# EAGLE design rc13-mbed-main-board2 (EAGLE 6.4)
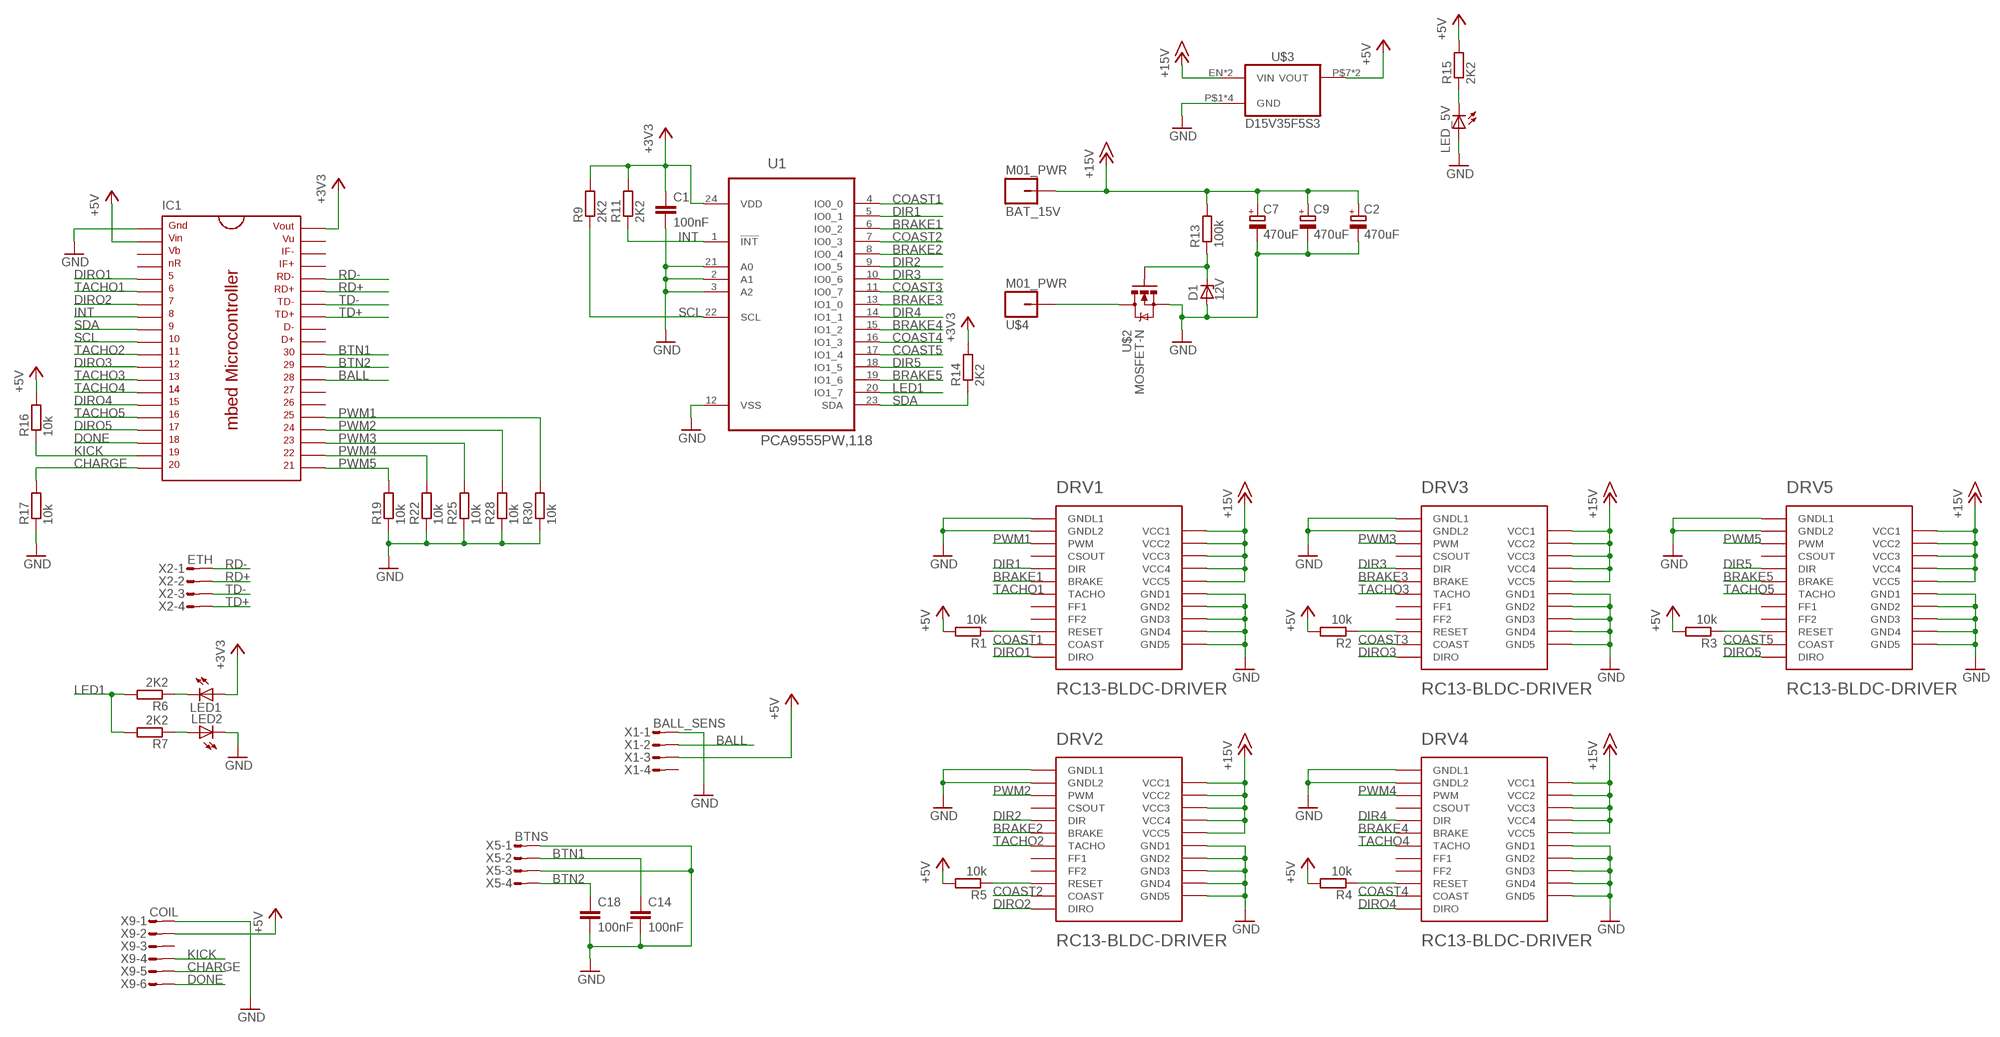
[diagram p0: schematic, sheet 1]

## Parts
BAT_15V  M01_PWR  [PWR_HOLE]
C1  100nF  C-EUC0603K  [C0603K]
C2  470uF  CPOL-EUE3.5-8  [E3,5-8]
C7  470uF  CPOL-EUE3.5-8  [E3,5-8]
C9  470uF  CPOL-EUE3.5-8  [E3,5-8]
C14  100nF  C-EUC0603K  [C0603K]
C18  100nF  C-EUC0603K  [C0603K]
D1  12V  ZENER-DIODESOD123  [SOD123]
DRV1  RC13-BLDC-DRIVER  [RC13-BLDC-DRIVER]
DRV2  RC13-BLDC-DRIVER  [RC13-BLDC-DRIVER]
DRV3  RC13-BLDC-DRIVER  [RC13-BLDC-DRIVER]
DRV4  RC13-BLDC-DRIVER  [RC13-BLDC-DRIVER]
DRV5  RC13-BLDC-DRIVER  [RC13-BLDC-DRIVER]
IC1  MBED_MICROCONTROLLER  [DIL40_0.9]
LED1  LEDCHIP-LED0603  [CHIP-LED0603]
LED2  LEDCHIP-LED0603  [CHIP-LED0603]
LED_5V  LEDCHIP-LED0603  [CHIP-LED0603]
R1  10k  R-EU_R0603  [R0603]
R2  10k  R-EU_R0603  [R0603]
R3  10k  R-EU_R0603  [R0603]
R4  10k  R-EU_R0603  [R0603]
R5  10k  R-EU_R0603  [R0603]
R6  2K2  R-EU_R0603  [R0603]
R7  2K2  R-EU_R0603  [R0603]
R9  2K2  R-EU_R0603  [R0603]
R11  2K2  R-EU_R0603  [R0603]
R13  100k  R-EU_R0603  [R0603]
R14  2K2  R-EU_R0603  [R0603]
R15  2K2  R-EU_R0603  [R0603]
R16  10k  R-EU_R0603  [R0603]
R17  10k  R-EU_R0603  [R0603]
R19  10k  R-EU_R0603  [R0603]
R22  10k  R-EU_R0603  [R0603]
R25  10k  R-EU_R0603  [R0603]
R28  10k  R-EU_R0603  [R0603]
R30  10k  R-EU_R0603  [R0603]
U1  PCA9555PW,118  [SOP65P640X110-24N]
U$2  MOSFET-N  MOSFET-N-SOT669  [TO127P600X120-5N]
U$3  D15V35F5S3  [D15V35F5S3]
U$4  M01_PWR  [PWR_HOLE]
X1  BALL_SENS  MICROMATCH-4  [MICROMATCH-4]
X2  ETH  MICROMATCH-4  [MICROMATCH-4]
X5  BTNS  MICROMATCH-4  [MICROMATCH-4]
X9  COIL  MICROMATCH-6  [MICROMATCH-6]

## Nets
+3V3: C1.1 IC1.40 LED1.A R9.2 R11.2 R14.2 U1.24(VDD)
+5V: IC1.2 R1.2 R2.2 R3.2 R4.2 R5.2 R15.2 R16.2 U$3.P$7(VOUT) U$3.P$8(VOUT) X1.3 X9.2
+15V: BAT_15V.P$1 C2.+ C7.+ C9.+ DRV1.PWR1(VCC1) DRV1.PWR2(VCC2) DRV1.PWR3(VCC3) DRV1.PWR4(VCC4) DRV1.PWR5(VCC5) DRV2.PWR1(VCC1) DRV2.PWR2(VCC2) DRV2.PWR3(VCC3) DRV2.PWR4(VCC4) DRV2.PWR5(VCC5) DRV3.PWR1(VCC1) DRV3.PWR2(VCC2) DRV3.PWR3(VCC3) DRV3.PWR4(VCC4) DRV3.PWR5(VCC5) DRV4.PWR1(VCC1) DRV4.PWR2(VCC2) DRV4.PWR3(VCC3) DRV4.PWR4(VCC4) DRV4.PWR5(VCC5) DRV5.PWR1(VCC1) DRV5.PWR2(VCC2) DRV5.PWR3(VCC3) DRV5.PWR4(VCC4) DRV5.PWR5(VCC5) R13.2 U$3.EN(VIN) U$3.P$5(VIN)
BALL: IC1.28 X1.2
BAT_GND: U$2.5(D) U$4.P$1
BRAKE1: DRV1.LOGIC6(BRAKE) U1.6(IO0_2)
BRAKE2: DRV2.LOGIC6(BRAKE) U1.8(IO0_4)
BRAKE3: DRV3.LOGIC6(BRAKE) U1.13(IO1_0)
BRAKE4: DRV4.LOGIC6(BRAKE) U1.15(IO1_2)
BRAKE5: DRV5.LOGIC6(BRAKE) U1.19(IO1_6)
BTN1: C14.1 IC1.30 X5.2
BTN2: C18.1 IC1.29 X5.4
CHARGE: IC1.20 R17.2 X9.5
COAST1: DRV1.LOGIC11(COAST) U1.4(IO0_0)
COAST2: DRV2.LOGIC11(COAST) U1.7(IO0_3)
COAST3: DRV3.LOGIC11(COAST) U1.11(IO0_7)
COAST4: DRV4.LOGIC11(COAST) U1.16(IO1_3)
COAST5: DRV5.LOGIC11(COAST) U1.17(IO1_4)
DIR1: DRV1.LOGIC5(DIR) U1.5(IO0_1)
DIR2: DRV2.LOGIC5(DIR) U1.9(IO0_5)
DIR3: DRV3.LOGIC5(DIR) U1.10(IO0_6)
DIR4: DRV4.LOGIC5(DIR) U1.14(IO1_1)
DIR5: DRV5.LOGIC5(DIR) U1.18(IO1_5)
DIRO1: DRV1.LOGIC12(DIRO) IC1.5
DIRO2: DRV2.LOGIC12(DIRO) IC1.7
DIRO3: DRV3.LOGIC12(DIRO) IC1.12
DIRO4: DRV4.LOGIC12(DIRO) IC1.15
DIRO5: DRV5.LOGIC12(DIRO) IC1.17
DONE: IC1.18 X9.6
GND: C1.2 C2.- C7.- C9.- C14.2 C18.2 D1.A DRV1.LOGIC1(GNDL1) DRV1.LOGIC2(GNDL2) DRV1.PWR6(GND1) DRV1.PWR7(GND2) DRV1.PWR8(GND3) DRV1.PWR9(GND4) DRV1.PWR10(GND5) DRV2.LOGIC1(GNDL1) DRV2.LOGIC2(GNDL2) DRV2.PWR6(GND1) DRV2.PWR7(GND2) DRV2.PWR8(GND3) DRV2.PWR9(GND4) DRV2.PWR10(GND5) DRV3.LOGIC1(GNDL1) DRV3.LOGIC2(GNDL2) DRV3.PWR6(GND1) DRV3.PWR7(GND2) DRV3.PWR8(GND3) DRV3.PWR9(GND4) DRV3.PWR10(GND5) DRV4.LOGIC1(GNDL1) DRV4.LOGIC2(GNDL2) DRV4.PWR6(GND1) DRV4.PWR7(GND2) DRV4.PWR8(GND3) DRV4.PWR9(GND4) DRV4.PWR10(GND5) DRV5.LOGIC1(GNDL1) DRV5.LOGIC2(GNDL2) DRV5.PWR6(GND1) DRV5.PWR7(GND2) DRV5.PWR8(GND3) DRV5.PWR9(GND4) DRV5.PWR10(GND5) IC1.1 LED2.C LED_5V.A R17.1 R19.1 R22.1 R25.1 R28.1 R30.1 U1.2(A1) U1.3(A2) U1.12(VSS) U1.21(A0) U$2.1(S) U$2.2(S) U$2.3(S) U$3.P$1(GND) U$3.P$2(GND) U$3.P$3(GND) U$3.P$4(GND) X1.1 X5.1 X5.3 X9.1
INT: IC1.8 R11.1 U1.1(!INT)
KICK: IC1.19 R16.1 X9.4
LED1: R6.2 R7.2 U1.20(IO1_7)
N$2: DRV1.LOGIC10(RESET) R1.1
N$3: DRV2.LOGIC10(RESET) R5.1
N$4: DRV4.LOGIC10(RESET) R4.1
N$5: DRV5.LOGIC10(RESET) R3.1
N$6: DRV3.LOGIC10(RESET) R2.1
N$7: LED1.C R6.1
N$8: LED2.A R7.1
N$9: LED_5V.C R15.1
N$20: D1.C R13.1 U$2.4(G)
PWM1: DRV1.LOGIC3(PWM) IC1.25 R30.2
PWM2: DRV2.LOGIC3(PWM) IC1.24 R28.2
PWM3: DRV3.LOGIC3(PWM) IC1.23 R25.2
PWM4: DRV4.LOGIC3(PWM) IC1.22 R22.2
PWM5: DRV5.LOGIC3(PWM) IC1.21 R19.2
RD+: IC1.35 X2.2
RD-: IC1.36 X2.1
SCL: IC1.10 R9.1 U1.22(SCL)
SDA: IC1.9 R14.1 U1.23(SDA)
TACHO1: DRV1.LOGIC7(TACHO) IC1.6
TACHO2: DRV2.LOGIC7(TACHO) IC1.11
TACHO3: DRV3.LOGIC7(TACHO) IC1.13
TACHO4: DRV4.LOGIC7(TACHO) IC1.14
TACHO5: DRV5.LOGIC7(TACHO) IC1.16
TD+: IC1.33 X2.4
TD-: IC1.34 X2.3
Unconnected: DRV1.LOGIC4(CSOUT) DRV1.LOGIC8(FF1) DRV1.LOGIC9(FF2) DRV2.LOGIC4(CSOUT) DRV2.LOGIC8(FF1) DRV2.LOGIC9(FF2) DRV3.LOGIC4(CSOUT) DRV3.LOGIC8(FF1) DRV3.LOGIC9(FF2) DRV4.LOGIC4(CSOUT) DRV4.LOGIC8(FF1) DRV4.LOGIC9(FF2) DRV5.LOGIC4(CSOUT) DRV5.LOGIC8(FF1) DRV5.LOGIC9(FF2) IC1.3 IC1.4 IC1.26 IC1.27 IC1.31 IC1.32 IC1.37 IC1.38 IC1.39 X1.4 X9.3

## Library data of the parts
BAT_15V U$4 = tellis2:M01_PWR
C1 C14 C18 = rcl:C-EU: CAPACITOR, European symbol
C2 C7 C9 = rcl:CPOL-EU: POLARIZED CAPACITOR, European symbol
D1 = diode:ZENER-DIODE: Z-Diode
DRV1-DRV5 = rc13-bldc-driver:RC13-BLDC-DRIVER
IC1 = mbed-microcontroller:MBED_MICROCONTROLLER: mbed Microcontroller, DIP40, 0.9"
LED1 LED2 LED_5V = led:LED: LED OSRAM: - CHIPLED LG R971, LG N971, LY N971, LG Q971, LY Q971, LO R971, LY R971 LH N974, LH R974 LS Q976, LO Q976, LY Q976 LO Q996 - Hyper CHIPLED LW Q18S LB Q993, LB Q99A, LB R99A - SideLED LS A670, LO A670, LY A670, LG A670, LP A670 LB A673, LV A673, LT A673, LW A673 LH A674 LY A675 LS A676, LA A676, LO A676, LY A676, LW A676 LS A679, LY A679, LG A679 - Hyper Micro SIDELED® LS Y876, LA Y876, LO Y876, LY Y876 LT Y87S - SmartLED LW L88C, LW L88S LB L89C, LB L89S, LG L890 LS L89K, LO L89K, LY L89K LS L896, LA L896, LO L896, LY L896 - TOPLED LS T670, LO T670, LY T670, LG T670, LP T670 LSG T670, LSP T670, LSY T670, LOP T670, LYG T670 LG T671, LOG T671, LSG T671 LB T673, LV T673, LT T673, LW T673 LH T674 LS T676, LA T676, LO T676, LY T676, LB T676, LH T676, LSB T676, LW T676 LB T67C, LV T67C, LT T67C, LS T67K, LO T67K, LY T67K, LW E67C LS E67B, LA E67B, LO E67B, LY E67B, LB E67C, LV E67C, LT E67C LW T67C LS T679, LY T679, LG T679 LS T770, LO T770, LY T770, LG T770, LP T770 LB T773, LV T773, LT T773, LW T773 LH T774 LS E675, LA E675, LY E675, LS T675 LS T776, LA T776, LO T776, LY T776, LB T776 LHGB T686 LT T68C, LB T68C - Hyper Mini TOPLED® LB M676 - Mini TOPLED Santana® LG M470 LS M47K, LO M47K, LY M47K Source: http://www.osram.convergy.de LUXEON: - LUMILED® LXK2-PW12-R00, LXK2-PW12-S00, LXK2-PW14-U00, LXK2-PW14-V00 LXK2-PM12-R00, LXK2-PM12-S00, LXK2-PM14-U00 LXK2-PE12-Q00, LXK2-PE12-R00, LXK2-PE12-S00, LXK2-PE14-T00, LXK2-PE14-U00 LXK2-PB12-K00, LXK2-PB12-L00, LXK2-PB12-M00, LXK2-PB14-N00, LXK2-PB14-P00, LXK2-PB14-Q00 LXK2-PR12-L00, LXK2-PR12-M00, LXK2-PR14-Q00, LXK2-PR14-R00 LXK2-PD12-Q00, LXK2-PD12-R00, LXK2-PD12-S00 LXK2-PH12-R00, LXK2-PH12-S00 LXK2-PL12-P00, LXK2-PL12-Q00, LXK2-PL12-R00 Source: www.luxeon.com KINGBRIGHT: KA-3528ASYC Source: www.kingbright.com
R1-R7 R9 R11 R13-R17 R19 R22 R25 R28 R30 = rcl:R-EU_: RESISTOR, European symbol
U1 = PCA9555:PCA9555PW,118: IC, I/O EXPANDER, 16BIT, 24TSSOP; MPN: PCA9555PW,118; OC_FARNELL: 2101299; OC_NEWARK: 70R6680; PACKAGE: 24TSSOP; SUPPLIER: NXP
U$2 = nxp_sot669:MOSFET-N-SOT669
U$3 = D15V35F5S3:D15V35F5S3
X1 X2 X5 = con-amp-micromatch:MICROMATCH-4: MicroMaTch 4 7-215464-4 / 0-215464-4 Drawing Number C-215464 DDEController.pdf; MPN: 7-215464-4; OC_FARNELL: 3784629; OC_NEWARK: 19R8124
X9 = con-amp-micromatch:MICROMATCH-6: MicroMaTch 6 7-215464-6 / 0-215464-6 Drawing Number C-215464 DDEController.pdf; MPN: 7-215464-6; OC_FARNELL: 3784630; OC_NEWARK: 19R8125

## Board
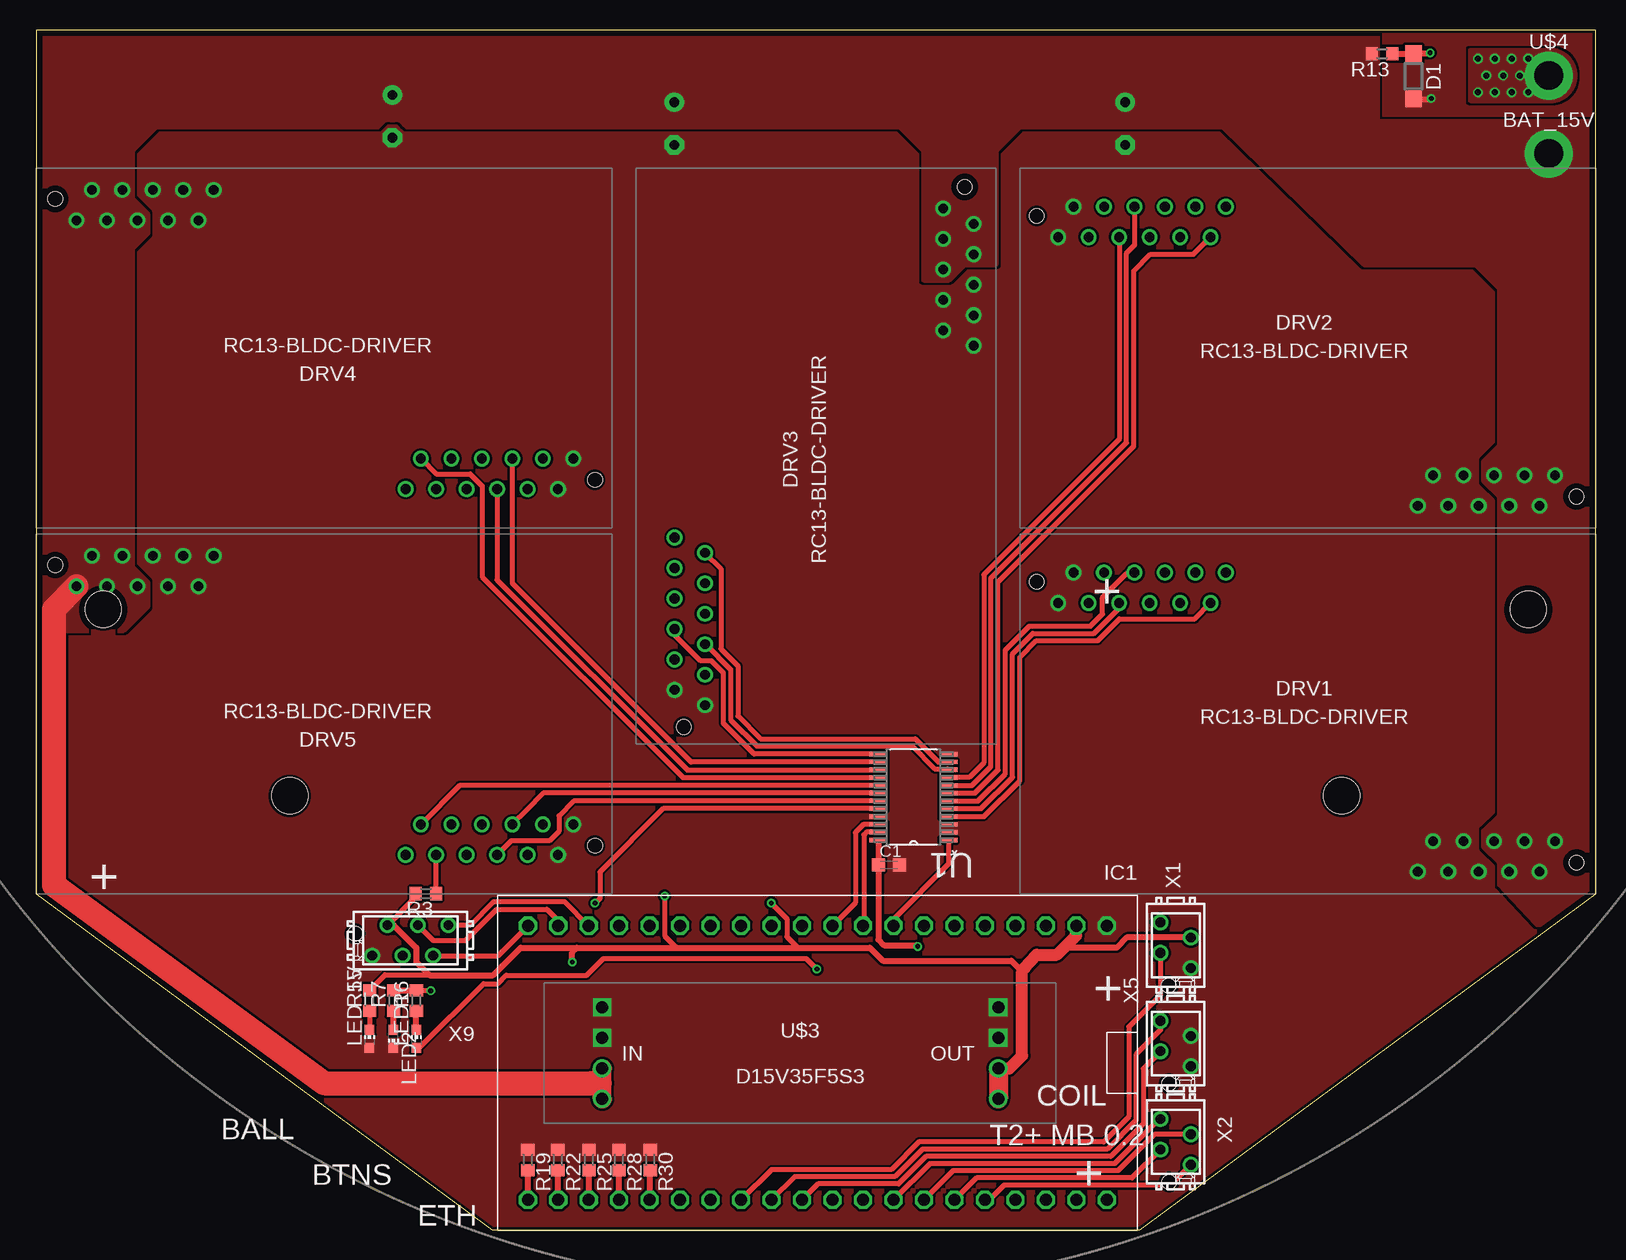
[diagram p1: board, top side]
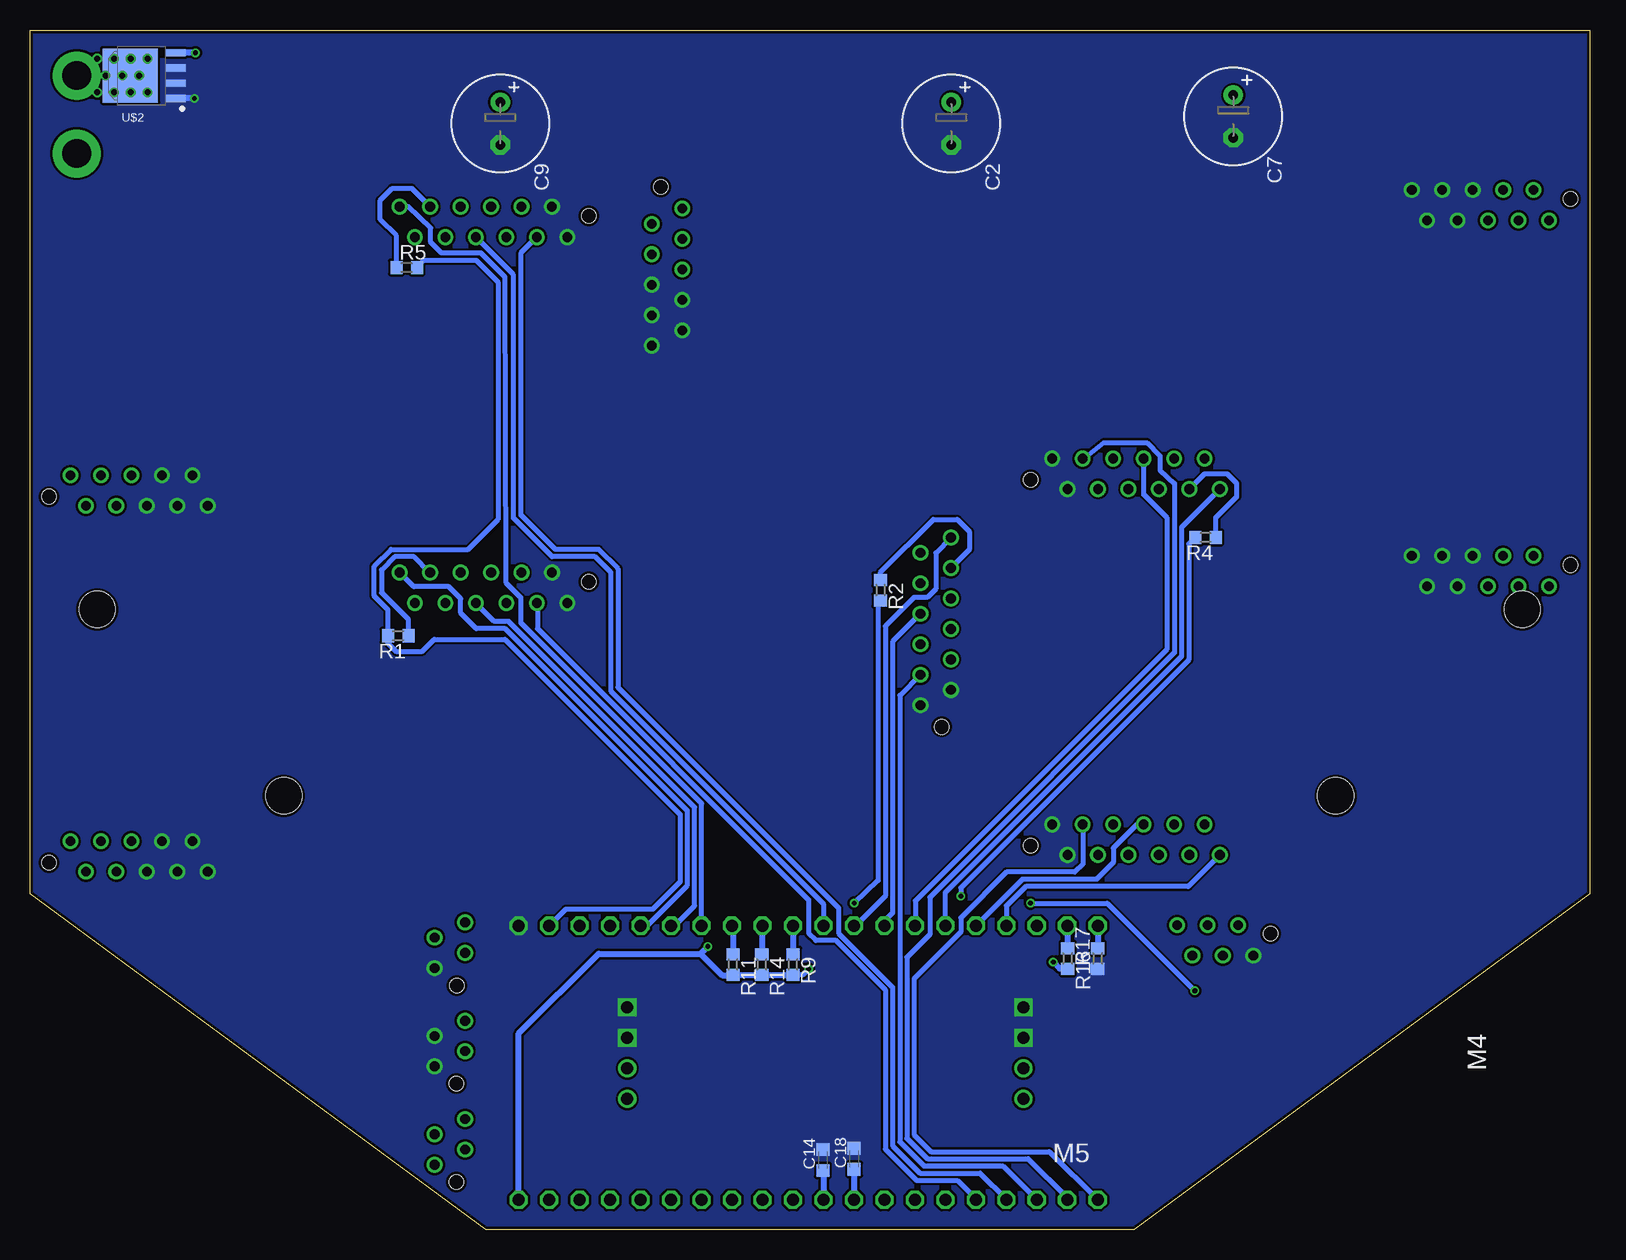
[diagram p2: board, bottom side, seen from below]

Size 130 x 100 mm. Coordinates in mm from the lower left corner, seen from the top.
Outline: 0,28 38,0 92,0 130,28 130,100 0,100 0,28
Copper layers (1*16): Top 0.035mm / dielectric 1.5mm / Bottom 0.035mm
Design rules "Fusion_eagle_rule_v1.1": minimum track width 6mil, minimum drill 12mil, track to track 6mil, track to pad 6mil, pad to pad 6mil, via to via 6mil, smd to smd 0mil, copper to edge 10mil, drill to drill 10mil, minimum pad ring 10mil, minimum via ring 6mil, stop-mask expansion 2mil, vias tented up to drill 100mil, thermal gap 10mil
Holes 1.2 mm at 94.45,3.95 94.45,12.15 94.4,20.35 26.6,24.65
Holes 3 mm at 5.6,51.7 21.16,36.16 108.84,36.16 124.4,51.7

### Footprints (pad centres in the part's own frame; a part is rotated, then mirrored left to right if it is on the bottom)
PWR_HOLE = drill 2.4 pad 4: P$1 0,0
C0603K = smd 1.05 x 1.08: 1 -0.875,0; 2 0.875,0
E3,5-8 = drill 0.813 pad 1.6: + -1.778,0 | drill 0.813 pad 1.6 octagon: - 1.778,0
SOD123 = smd 1.4 x 1.4: A 1.9,0; C -1.9,0
RC13-BLDC-DRIVER = drill 0.8 pad 1.3: LOGIC1 3.215,24.23; LOGIC2 4.485,26.77; LOGIC3 5.755,24.23; LOGIC4 7.025,26.77; LOGIC5 8.295,24.23; LOGIC6 9.565,26.77; LOGIC7 10.835,24.23; LOGIC8 12.105,26.77; LOGIC9 13.375,24.23; LOGIC10 14.645,26.77; LOGIC11 15.915,24.23; LOGIC12 17.185,26.77; PWR1 44.615,4.37; PWR2 43.345,1.83; PWR3 42.075,4.37; PWR4 40.805,1.83; PWR5 39.535,4.37; PWR6 38.265,1.83; PWR7 36.995,4.37; PWR8 35.725,1.83; PWR9 34.455,4.37; PWR10 33.185,1.83 | hole 1.2: 1.4,26; 46.4,2.6
DIL40_0.9 = drill 1 pad 1.397 octagon: 1 -22.86,-11.43; 2 -20.32,-11.43; 3 -17.78,-11.43; 4 -15.24,-11.43; 5 -12.7,-11.43; 6 -10.16,-11.43; 7 -7.62,-11.43; 8 -5.08,-11.43; 9 -2.54,-11.43; 10 0,-11.43; 11 2.54,-11.43; 12 5.08,-11.43; 13 7.62,-11.43; 14 10.16,-11.43; 15 12.7,-11.43; 16 15.24,-11.43; 17 17.78,-11.43; 18 20.32,-11.43; 19 22.86,-11.43; 20 25.4,-11.43; 21 25.4,11.43; 22 22.86,11.43; 23 20.32,11.43; 24 17.78,11.43; 25 15.24,11.43; 26 12.7,11.43; 27 10.16,11.43; 28 7.62,11.43; 29 5.08,11.43; 30 2.54,11.43; 31 0,11.43; 32 -2.54,11.43; 33 -5.08,11.43; 34 -7.62,11.43; 35 -10.16,11.43; 36 -12.7,11.43; 37 -15.24,11.43; 38 -17.78,11.43; 39 -20.32,11.43; 40 -22.86,11.43
CHIP-LED0603 = smd 0.8 x 0.8: A 0,-0.75; C 0,0.75
R0603 = smd 1 x 1.1: 1 -0.85,0; 2 0.85,0
SOP65P640X110-24N = smd 1.473 x 0.356: 1 -2.921,3.581; 2 -2.921,2.921; 3 -2.921,2.286; 4 -2.921,1.626; 5 -2.921,0.965; 6 -2.921,0.33; 7 -2.921,-0.33; 8 -2.921,-0.965; 9 -2.921,-1.626; 10 -2.921,-2.286; 11 -2.921,-2.921; 12 -2.921,-3.581; 13 2.921,-3.581; 14 2.921,-2.921; 15 2.921,-2.286; 16 2.921,-1.626; 17 2.921,-0.965; 18 2.921,-0.33; 19 2.921,0.33; 20 2.921,0.965; 21 2.921,1.626; 22 2.921,2.286; 23 2.921,2.921; 24 2.921,3.581
TO127P600X120-5N = smd 1.65 x 0.6: 1 -2.65,1.905; 2 -2.65,0.635; 3 -2.65,-0.635; 4 -2.65,-1.905 | smd 4.6 x 4.5: 5 1.15,0
D15V35F5S3 = drill 1: EN -16.51,-3.81; P$5 -16.51,-1.27; P$7 16.51,-1.27; P$8 16.51,-3.81 | drill 1 square: P$1 -16.51,3.81; P$2 -16.51,1.27; P$3 16.51,3.81; P$4 16.51,1.27
MICROMATCH-4 = drill 0.813: 1 1.905,1.27; 2 0.635,-1.27; 3 -0.635,1.27; 4 -1.905,-1.27
MICROMATCH-6 = drill 0.813: 1 3.175,1.27; 2 1.905,-1.27; 3 0.635,1.27; 4 -0.635,-1.27; 5 -1.905,1.27; 6 -3.175,-1.27

### Placement (x,y rotation side)
BAT_15V  126.1,89.7 0 top
C1  71.1,30.4 0 top
C2  53.2,92.2 270 bottom
C7  29.7,92.8 270 bottom
C9  90.8,92.2 270 bottom
C14  63.9,5.8 90 bottom
C18  61.3,5.9 90 bottom
D1  114.84,96.15 270 top
DRV1  82,28 0 top
DRV2  82,58.5 0 top
DRV3  80,40.5 90 top
DRV4  48,88.5 180 top
DRV5  48,58 180 top
IC1  66.4,13.9 180 top
LED1  31.7,15.9 0 top
LED2  29.8,15.9 180 top
LED_5V  27.8,15.9 0 top
R1  99.3,49.5 180 bottom
R2  59.1,53.3 270 bottom
R3  32.5,28 180 top
R4  32,57.7 180 bottom
R5  98.6,80.2 0 bottom
R6  31.7,19.1 90 top
R7  29.8,19.1 90 top
R9  66.4,22.1 270 bottom
R11  71.4,22.1 270 bottom
R13  112.21,98.01 180 top
R14  69,22.1 270 bottom
R15  27.8,19.1 90 top
R16  43.5,22.6 270 bottom
R17  41,22.6 90 bottom
R19  41,5.8 270 top
R22  43.5,5.8 270 top
R25  46.1,5.8 270 top
R28  48.6,5.8 270 top
R30  51.2,5.8 270 top
U1  73.15,36.05 180 top
U$2  120.5,96.2 180 bottom
U$3  63.7,14.7 0 top
U$4  126.1,96.2 0 top
X1  95,23.7 270 top
X2  95,7.3 270 top
X5  95,15.5 270 top
X9  31.2,24.1 180 top

### Tracks (layer width: path | path; a pad name or v marks a point on that pad's centre or on a via)
+3V3  (via drill 0.4)
  Top 0.4: LED1.A 31.95,15.15 37.3,20.5 38.5,20.5 39.2,21.2 45.9,21.2 47.3,22.6 64.2,22.6 v65.1,21.7
  Top 0.5: U1.24 C1.1 70.22,24.18 70.7,23.7 73.4,23.7 v73.5,23.6
  Bottom 0.4: v65.1,21.7 65.55,21.25 R9.2
  Bottom 0.5: IC1.40 89.26,16.34 82.6,23 74.1,23 | 74.1,23 72.3,21.2 71.45,21.2 R11.2 R14.2 R9.2 | v73.5,23.6 74.1,23
+5V  (via drill 0.4)
  Top 0.4: 31.65,27.73 X9.2 | R15.2 29.1,21.25 32.75,21.25 | v61.3,27.2 62.6,25.9 62.6,24.4 63.5,23.5 | v52.4,27.8 52.4,24.5 53.4,23.5
  Top 0.5: X1.3 90.94,24.34 90.1,23.5 85.7,23.5 | X9.2 29.83,25.37 31.7,23.5 31.7,22.3 32.75,21.25 32.8,21.2 38.1,21.2 40.4,23.5 45.1,23.5 | 82.4,21.8 81.9,21.8 81.3,22.4 70.6,22.4 69.5,23.5 63.5,23.5 53.4,23.5 45.1,23.5 | R3.2 31.65,27.73 | v44.7,22.3 44.7,23.1 45.1,23.5 | 87,25.61 IC1.2
  Top 1: U$3.P$7 81.13,13.43 82.2,14.5 82.2,21.5 82.4,21.8 83.4,22.9 85.1,22.9 85.7,23.5 86.7,24.5 86.7,25.31 IC1.2
  Top 1.6: U$3.P$7 U$3.P$8
  Bottom 0.4: v61.3,27.2 59.3,29.1 59.3,52.25 R2.2 | R4.2 33.4,57.15 33.4,47.5 52.4,28.5 v52.4,27.8 | R5.2 97.15,80.8 92.8,80.8 91,79 91,59.2 93.5,56.7 99.9,56.7 101.3,55.3 101.3,52.8 100.15,51.65 R1.2 100.15,48.85 99.5,48.2 97.3,48.2 96.3,49.2 90.4,49.2 75.8,34.6 75.8,29 78.1,26.7 85.35,26.7 IC1.2
  Bottom 0.5: R16.2 44.15,21.75 v44.7,22.3
+15V
  Top 1.6: U$3.EN 47.19,12.2 | 47.19,12.2 U$3.P$5 | 46.3,12.2 47.19,12.2
  Top 2: DRV5.PWR1 1.5,51.72 1.5,28.7 24,12.2 46.3,12.2
  pour Top (isolate 0.5, no thermals): 122,30.6 122,28.8 125.7,24.9 130,28 129.9,92.3 111.8,92.3 111.8,99.9 0,100 0,50 7.3,50 9.3,52 9.3,53.9 8,55.2 8,81.8 9.3,83.1 9.3,84.6 8,85.9 8,90 10,92 72,92 74,90 74,79.2 76.1,79.2 77.4,80.5 80,80.5 80,90 82,92 98.9,92 110.7,80.5 120,80.5 122,78.5 122,65.3 120.7,64 120.7,62.4 122,61.1 122,34.5 120.7,33.2 120.7,31.9
BALL
  Top 0.4: X1.2 93.73,19.53 91.1,16.9 91.1,9.4 89,7.3 73.6,7.3 71.3,5 61.31,5 IC1.28
BAT_GND  (via drill 0.5)
  Bottom 0.4: v122.3,96.2 U$2.5
  other vias: 120.2,97.6 120.9,96.2 120.2,94.8 121.6,97.6 121.6,94.8 123,97.6 123.7,96.2 123,94.8 124.4,97.6 124.4,94.8
  pour Top (isolate 0.5, no thermals): 119.6,98.25 119.6,94.15 126.25,94.15 arc90 128.25,96.15 128.25,96.25 arc90 126.25,98.25
BRAKE1
  Top 0.4: U1.6 78.52,35.72 80.8,38 80.8,48.3 82.8,50.3 87.9,50.3 88.9,51.3 88.9,52.7 90.9,54.7 91.5,54.7 DRV1.LOGIC6
BRAKE2
  Top 0.4: U1.8 78.02,37.02 79.6,38.6 79.6,54.3 90.9,65.6 90.9,81.4 91.6,82.1 91.6,85.23 DRV2.LOGIC6
BRAKE3
  Top 0.4: U1.13 59.87,39.63 57.3,42.2 57.3,46.4 56.3,47.4 55.4,47.4 53.3,49.5 53.3,49.99 DRV3.LOGIC6
BRAKE4
  Top 0.4: DRV4.LOGIC6 38.44,54.16 54.3,38.3 70.19,38.3 U1.15
BRAKE5
  Top 0.4: U1.19 44.82,35.72 43.6,34.5 43.6,33.2 42.8,32.4 39.6,32.4 DRV5.LOGIC6
BTN1
  Top 0.4: X5.2 93.73,14.83 92.3,13.4 92.3,8.8 89.6,6.1 74.2,6.1 71.9,3.8 65.19,3.8 IC1.30
  Bottom 0.5: C14.1 63.86,4.88 IC1.30
BTN2
  Top 0.4: X5.4 93.73,16.63 91.7,14.6 91.7,9.1 89.3,6.7 73.9,6.7 71.6,4.4 63.25,4.4 IC1.29
  Bottom 0.5: C18.1 61.32,5 IC1.29
CHARGE
  Top 0.406: X9.5 38.5,22.83 IC1.20
  Bottom 0.5: IC1.20 R17.2
COAST1
  Top 0.4: U1.4 79.02,34.42 82,37.4 82,47.7 83.4,49.1 88.5,49.1 90.3,50.9 96.58,50.9 DRV1.LOGIC11
COAST2
  Top 0.4: U1.7 78.28,36.38 80.2,38.3 80.2,54 91.5,65.3 91.5,79.9 92.9,81.3 96.48,81.3 DRV2.LOGIC11
COAST3
  Top 0.4: DRV3.LOGIC11 57.1,55.09 57.1,48.4 58.5,47 58.5,42.8 60.4,40.9 73.3,40.9 75.23,38.97 U1.11
COAST4
  Top 0.4: DRV4.LOGIC11 33.35,63 36.2,63 37.2,62 37.2,54.4 53.92,37.68 U1.16
COAST5
  Top 0.4: U1.17 35.33,37.02 DRV5.LOGIC11
DIR1
  Top 0.4: U1.5 78.78,35.09 81.4,37.7 81.4,48 83.1,49.7 88.2,49.7 90.2,51.7 90.2,52.13 DRV1.LOGIC5
DIR2
  Top 0.4: DRV2.LOGIC5 90.3,65.89 79,54.6 79,38.9 77.8,37.7 76.09,37.7 U1.9
DIR3
  Top 0.4: DRV3.LOGIC5 55.8,48.8 57.9,46.7 57.9,42.5 60.1,40.3 73,40.3 74.9,38.4 76.01,38.4 U1.10
DIR4
  Top 0.4: DRV4.LOGIC5 39.7,53.9 54.45,39.15 54.6,39
  Top 0.406: U1.14 54.63,38.97 54.45,39.15
DIR5
  Top 0.4: U1.18 42.28,36.38 40.9,35 40.94,35 DRV5.LOGIC5
DIRO1
  Bottom 0.4: DRV1.LOGIC12 98.02,53.6 95.1,53.6 94.1,52.6 94.1,51.4 92.8,50.1 90.4,50.1 75.2,34.9 75.2,28.7 78.57,25.33 IC1.5
DIRO2
  Bottom 0.4: DRV2.LOGIC12 98.47,85.27 96.6,83.5 96.6,82.3 95.7,81.4 92.4,81.4 90.4,79.4 90.3,53.9 89.1,52.7 89.1,50.6 74.02,35.52 IC1.7
DIRO3
  Bottom 0.4: DRV3.LOGIC12 54.5,56.41 54.5,53.4 55.2,52.7 56.3,52.7 58.7,50.3 58.7,27.8 61.17,25.33 IC1.12
DIRO4
  Bottom 0.4: IC1.15 53.7,28.1 34,47.8 34,58.55 DRV4.LOGIC12
DIRO5
  Bottom 0.4: DRV5.LOGIC12 33.45,28.6 47,28.6 48.62,26.98 IC1.17
DONE
  Top 0.406: IC1.18 44.11,27.3 38.1,27.3 36.17,25.37 X9.6
GND  (via drill 0.4)
  Top 0.5: D1.A 116.25,94.25 v116.3,94.3
  Bottom 0.5: v116.3,94.3 U$2.1
  pour Top (isolate 0.2, rank 2, no thermals): 0,100 0,28 38,0 92,0 130,28 130,100
  pour Bottom (isolate 0.2, no thermals): 0,100 0,28 38,0 92,0 130,28 130,100
INT
  Top 0.4: U1.1 76.07,30.47 71.5,25.9 71.5,25.35 IC1.8
  Bottom 0.5: IC1.8 71.4,25.25 R11.1
KICK
  Top 0.406: X9.4 33.1,24.1 35.8,24.1 38.4,26.7 42.6,26.7 43.54,25.76 IC1.19
  Bottom 0.5: IC1.19 43.54,23.49 R16.1
LED1  (via drill 0.4)
  Top 0.4: U1.20 52.28,35.09 47,29.8 47,27.6 v46.6,27.2 | v32.9,19.9 31.75,19.9 R6.2
  Top 0.5: R7.2 R6.2
  Bottom 0.4: v46.6,27.2 40.2,27.2 v32.9,19.9
N$2
  Bottom 0.4: DRV1.LOGIC10 96.67,54.77 98,56.1 99.6,56.1 100.7,55 100.7,53.1 98.5,50.9 98.5,49.55 R1.1
N$3
  Bottom 0.4: R5.1 99.45,82.85 100.8,84.2 100.8,85.8 99.8,86.8 98.17,86.8 DRV2.LOGIC10
N$4
  Bottom 0.4: R4.1 31.15,59.35 29.4,61.1 29.4,62.2 30.2,63 32.09,63 DRV4.LOGIC10
N$5
  Top 0.4: R3.1 DRV5.LOGIC10
N$6
  Bottom 0.4: R2.1 59.1,54.8 54.7,59.2 52.7,59.2 51.7,58.2 51.7,56.67 DRV3.LOGIC10
N$7
  Top 0.5: LED1.C R6.1
N$8
  Top 0.5: LED2.A R7.1
N$9
  Top 0.4: R15.1 LED_5V.C
N$20  (via drill 0.4)
  Top 0.5: R13.1 115.2,98.01 D1.C 116.05,98.05 v116.2,98.1
  Bottom 0.5: v116.2,98.1 U$2.4
PWM1
  Top 0.5: IC1.25 51.2,2.51 R30.2
  Bottom 0.4: DRV1.LOGIC3 87.7,52.17 87.7,50.1 65.1,27.5 65.1,24.7 64.5,24.1 62.8,24.1 58.7,20 58.7,6.7 56.1,4.1 52.7,4.1 51.16,2.56 IC1.25
PWM2
  Top 0.5: IC1.24 48.6,2.49 R28.2
  Bottom 0.4: DRV2.LOGIC3 89.1,81.39 89.1,59.6 86.2,56.7 82.6,56.7 81,55.1 | 62.6,26.8 62.6,24.7 58.1,20.2 58.1,7 55.8,4.7 50.8,4.7 48.62,2.52 IC1.24
  Bottom 0.406: 81,55.1 81,45.2 62.6,26.8
PWM3
  Top 0.5: IC1.23 46.1,2.49 R25.2
  Bottom 0.4: 57.5,44.52 57.5,7.3 55.5,5.3 48.91,5.3 IC1.23
  Bottom 0.406: DRV3.LOGIC3 57.5,44.52
PWM4
  Top 0.5: IC1.22 43.5,2.51 R22.2
  Bottom 0.4: 55,27.7 55,24.6 56.9,22.7 56.9,7.6 55.2,5.9 46.8,5.9 43.54,2.64 IC1.22
  Bottom 0.406: DRV4.LOGIC3 42.13,64.27 40.5,65.6 36.9,65.6 35.8,64.5 35.8,63.3 34.6,62.2 34.6,48.1 55,27.7
PWM5
  Top 0.5: IC1.21 R19.2
  Bottom 0.4: DRV5.LOGIC3 42.24,30.45 42.9,29.8 48.6,29.8 52.4,26 52.4,24.8 56.3,20.9 56.3,7.9 54.9,6.5 45.03,6.5 IC1.21
RD+
  Top 0.4: X2.2 91.36,4.3 78.4,4.3 IC1.35
RD-
  Top 0.4: X2.1 94.58,3.7 80.7,3.7 79.47,2.47 IC1.36
SCL
  Top 0.4: U1.22 68.96,33.76 68.3,33.1 68.3,27.23 IC1.10
  Bottom 0.5: IC1.10 R9.1
SDA
  Top 0.4: U1.23 69.23,33.13 69,32.9 69,25.39 IC1.9
  Bottom 0.5: IC1.9 69,25.27 R14.1
TACHO1
  Bottom 0.4: IC1.6 76.27,25.33 74.6,27 74.6,35.2 90.1,50.7 91.31,50.7 DRV1.LOGIC7
TACHO2
  Bottom 0.4: IC1.11 63.86,27.16 81.6,44.9 81.6,54.8 82.9,56.1 86.5,56.1 89.7,59.3 89.7,79.6 DRV2.LOGIC7
TACHO3
  Bottom 0.4: DRV3.LOGIC7 58.1,49.01 58.1,26.4 58.78,25.72 IC1.13
TACHO4
  Bottom 0.4: 56.2,27.4 56.2,25.37 IC1.14 | 37.16,46.44 35.2,48.4 35.2,59.3 37.16,61.27 DRV4.LOGIC7
  Bottom 0.406: 37.16,46.44 56.2,27.4
TACHO5
  Bottom 0.4: DRV5.LOGIC7 37.73,33.77 39.7,31.8 39.7,30.6 41.1,29.2 47.29,29.2 IC1.16
TD+
  Top 0.4: X2.4 93.61,9.21 89.9,5.5 74.51,5.5 IC1.33
TD-
  Top 0.4: X2.3 93.23,7.93 90.2,4.9 76.45,4.9 IC1.34

### Text on the board
tNames: + | + | + | COIL | BALL | T2+ MB 0.2 | BTNS | + | ETH
bNames: M4 | M5